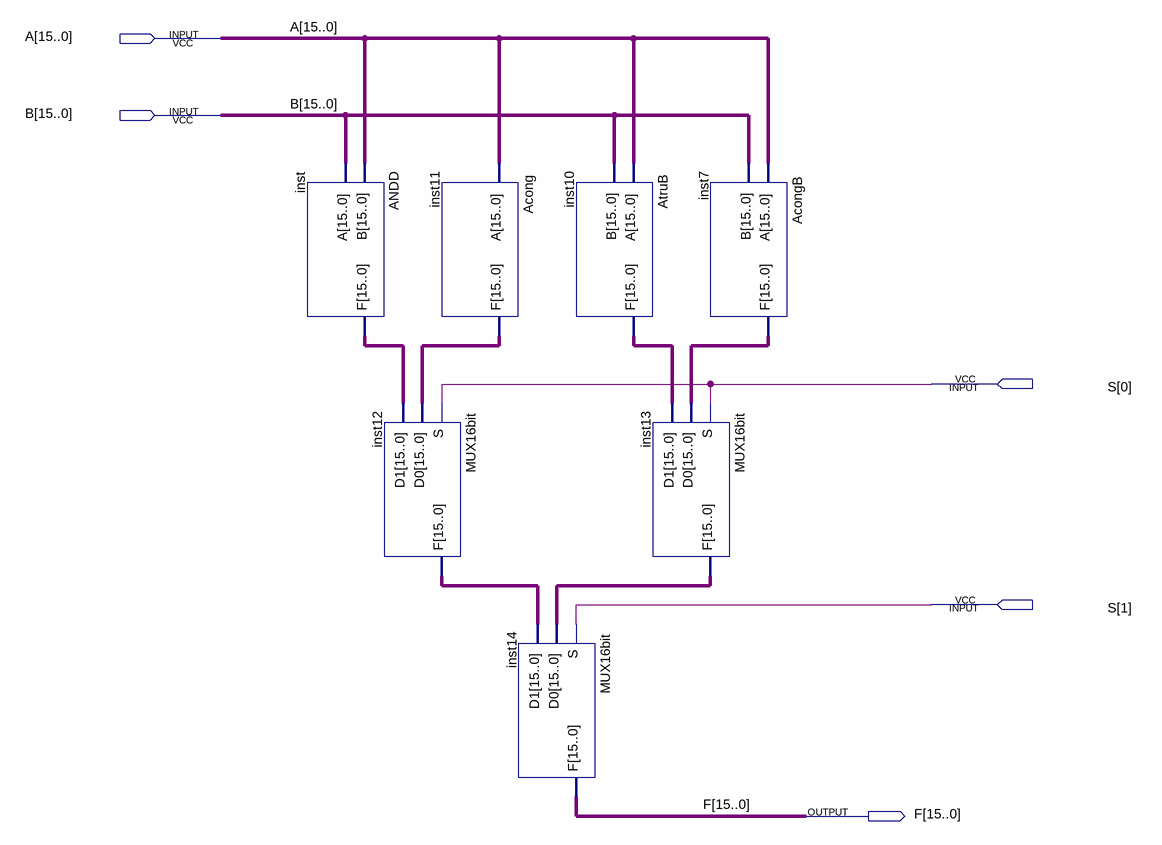
[diagram p0: schematic sheet]
// Quartus schematic ALU.bdf as structural Verilog: 7 symbols, 5 pins
module ALU (
  input  [15:0] A,
  input  [15:0] B,
  input  [1:0] S,
  output [15:0] F
);

  wire [15:0] inst7_f, inst10_f, inst11_f, inst12_f, inst13_f, inst_f;

  ANDD inst (.B(A), .A(B), .F(inst_f));
  Acong inst11 (.A(A), .F(inst11_f));
  MUX16bit inst12 (.S(S[0]), .D0(inst11_f), .D1(inst_f), .F(inst12_f));
  MUX16bit inst14 (.S(S[1]), .D0(inst13_f), .D1(inst12_f), .F(F));
  AtruB inst10 (.A(A), .B(B), .F(inst10_f));
  MUX16bit inst13 (.S(S[0]), .D0(inst7_f), .D1(inst10_f), .F(inst13_f));
  AcongB inst7 (.A(A), .B(B), .F(inst7_f));
endmodule
